# Altium schematic sheet 05_RPI_STROAGE.SchDoc
size A4; Revision: A
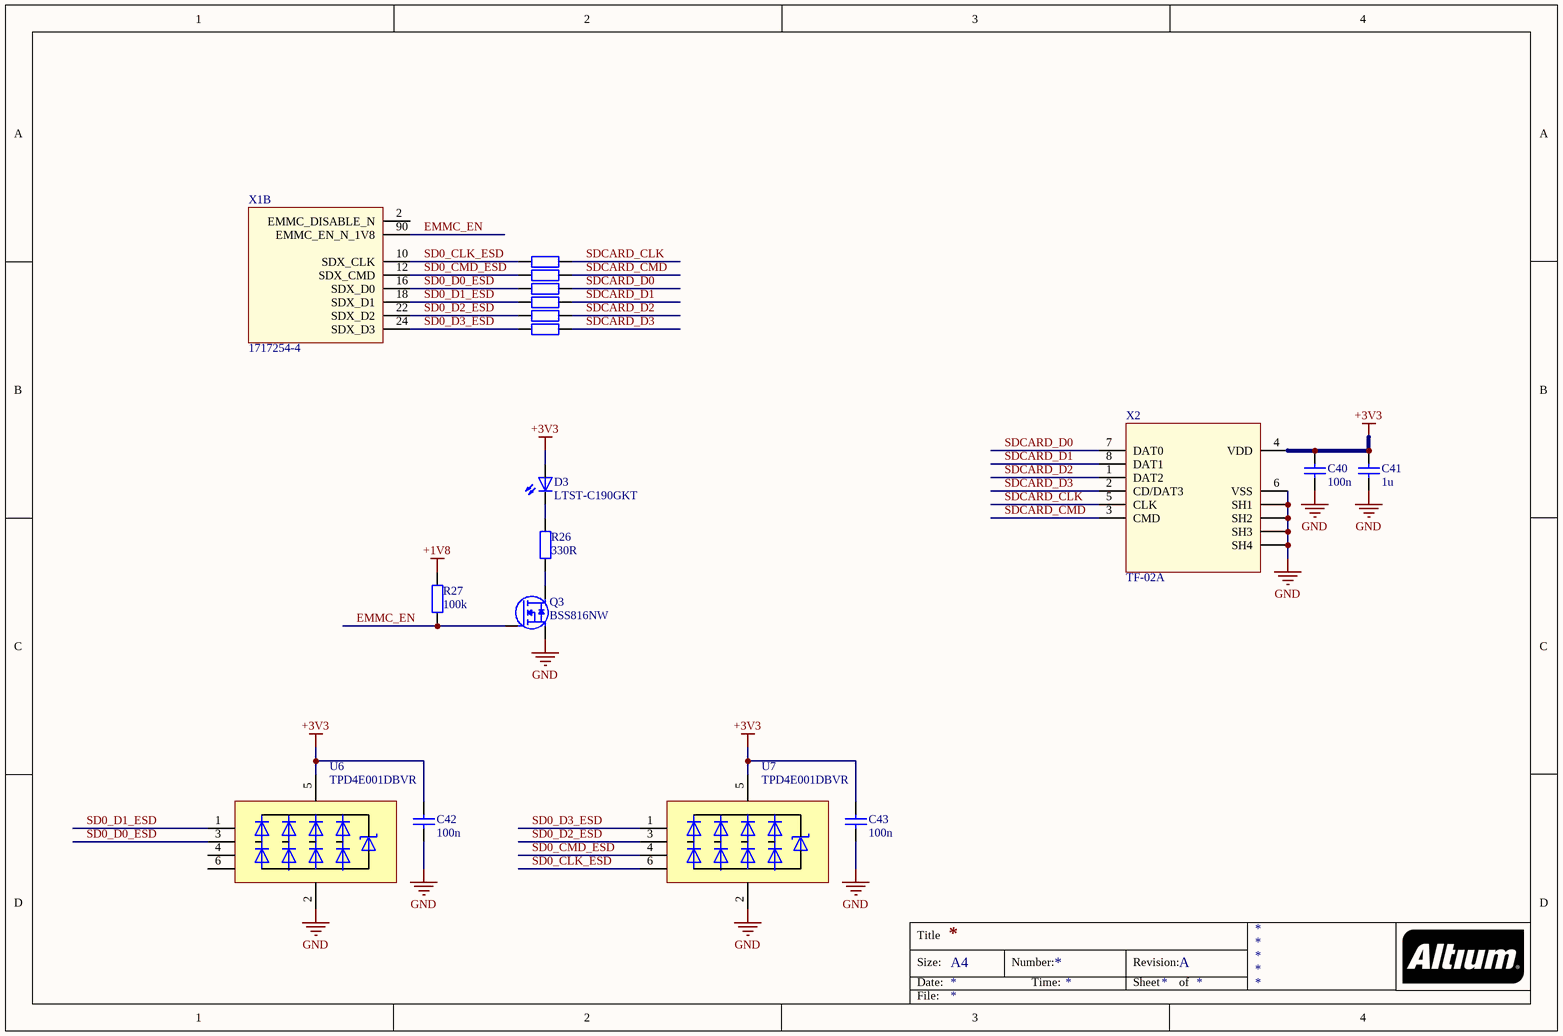
[diagram p0: 05_RPI_STROAGE.SchDoc]

## Parts
C40  100n  [C0603_IPC_HD]
C41  1u  [C0603_IPC_HD]
C42  100n  [C0603_IPC_HD]
C43  100n  [C0603_IPC_HD]
D3  LTST-C190GKT  [LED_0603]
Q3  BSS816NW  [SOT323]
R20  22R  [R0603_IPC_MD]  (value not drawn)
R21  22R  [R0603_IPC_MD]  (value not drawn)
R22  22R  [R0603_IPC_MD]  (value not drawn)
R23  22R  [R0603_IPC_MD]  (value not drawn)
R24  22R  [R0603_IPC_MD]  (value not drawn)
R25  22R  [R0603_IPC_MD]  (value not drawn)
R26  330R  [R0603_IPC_MD]
R27  100k  [R0603_IPC_MD]
U6  TPD4E001DBVR  [SOT23-6]
U7  TPD4E001DBVR  [SOT23-6]
X1  1717254-4  [1717254-1]  (part B of 7)
X2  TF-02A  [TF-02A]

## Nets
+1V8: R27.2
+3V3: C40.2 C41.2 C42.2 C43.2 D3.2(A) U6.5(VCC) U7.5(VCC) X2.4(VDD)
GND: C40.1 C41.1 C42.1 C43.1 Q3.2(S) U6.2(GND) U7.2(GND) X2.6(VSS) X2.9(SH1) X2.10(SH2) X2.11(SH3) X2.12(SH4)
EMMC_EN: Q3.1(G) R27.1 X1.90(EMMC_EN_N_1V8)
SD0_CLK_ESD: R20.1 U7.6(IO4) X1.10(SDX_CLK)
SD0_CMD_ESD: R21.1 U7.4(IO3) X1.12(SDX_CMD)
SD0_D0_ESD: R22.1 U6.3(IO2) X1.16(SDX_D0)
SD0_D1_ESD: R23.1 U6.1(IO1) X1.18(SDX_D1)
SD0_D2_ESD: R24.1 U7.3(IO2) X1.22(SDX_D2)
SD0_D3_ESD: R25.1 U7.1(IO1) X1.24(SDX_D3)
SDCARD_CLK: R20.2 X2.5(CLK)
SDCARD_CMD: R21.2 X2.3(CMD)
SDCARD_D0: R22.2 X2.7(DAT0)
SDCARD_D1: R23.2 X2.8(DAT1)
SDCARD_D2: R24.2 X2.1(DAT2)
SDCARD_D3: R25.2 X2.2(CD/DAT3)
NetD3_1: D3.1(C) R26.2
NetQ3_3: Q3.3(D) R26.1

Not connected (* = marked no-connect by the designer): U6 4(IO3) 6(IO4); X1 2(EMMC_DISABLE_N)

## Notes on the sheet
- Title
- Size:
- Date:
- A4
- Number:
- Time:
- Revision:
- Sheet
- of
- File:

## Library data of the parts
C40 C42 C43 = CL10B104KO8NNNC: CAP CER 0.1UF 16V X7R 0603; Manufacturer: Samsung Electro-Mechanics; Manufacturer Part Number: CL10B104KO8NNNC; Voltage: 16V; Value: 100n; Dielectric: X7R; Supplier 1: Digi-Key; Supplier Part Number 1: 1276-1005-1-ND
C41 = CL10B105MO8NNWC: CAP CER 1UF 16V X7R 0603; Manufacturer: Samsung Electro-Mechanics; Manufacturer Part Number: CL10B105MO8NNWC; Voltage: 16V; Value: 1u; Dielectric: X7R; Supplier 1: Digi-Key; Supplier Part Number 1: 1276-6524-1-ND
D3 = LTST-C190GKT: LED GREEN CLEAR CHIP SMD 0603; Manufacturer: Lite-On Inc.; Manufacturer Part Number: LTST-C190GKT; Color: Green; Supplier 1: Digi-Key; Supplier Part Number 1: 160-1183-1-ND
Q3 = BSS816: N-Channel Logic Level Enhancement Mode Field Effect Transistor; Manufacturer: Infineon Technologies; Manufacturer Part Number: BSS816NW; Supplier 1: Digi-Key; Supplier Part Number 1: BSS816NWH6327XTSA1CT-ND
R20-R25 = CR0603-JW-220ELF: RES SMD 22 OHM 5% 1/10W 0603; Manufacturer: Bourns Inc.; Value: 22R; Tolarance: 5%; Manufacturer Part Number: CR0603-JW-220ELF; Supplier 1: Digi-Key; Supplier Part Number 1: CR0603-JW-220ELFCT-ND
R26 = CR0603-JW-331ELF: RES SMD 330 OHM 5% 1/10W 0603; Manufacturer: Bourns Inc.; Value: 330R; Tolarance: 5%; Manufacturer Part Number: CR0603-JW-331ELF; Supplier 1: Digi-Key; Supplier Part Number 1: CR0603-JW-331ELFCT-ND
R27 = RMCF0603FT100K: RES 100K OHM 1% 1/10W 0603; Manufacturer: Bourns Inc.; Value: 100k; Tolarance: 1%; Manufacturer Part Number: RMCF0603FT100K; Supplier 1: Digi-Key; Supplier Part Number 1: RMCF0603FT100KCT-ND
U6 U7 = TPD4E001DBVR: 4x TVS DIODE 5.5V SOT23-6; Manufacturer: TI; Manufacturer Part Number: TPD4E001DBVR; Supplier 1: Digi-Key; Supplier Part Number 1: 296-28203-1-ND
X1 = Raspberry CM Connector: CONN SKT SODIMM 200POS R/A SMD; Manufacturer: TE Connectivity AMP Connectors; Manufacturer Part Number: 1717254-4; Supplier 1: Digi-Key; Supplier Part Number 1: A130932CT-ND
X2 = TF-02A: CONN MICRO SD CARD; Manufacturer: Korean Hroparts Elec; Manufacturer Part Number: TF-02A; Supplier 1: LCSC; Supplier Part Number 1: C105419